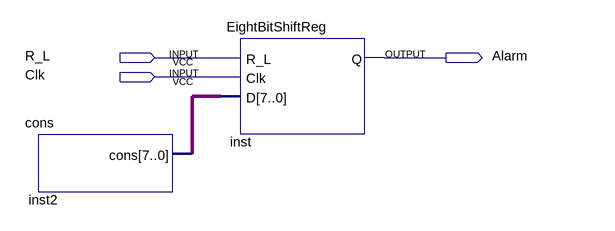
[diagram p0: schematic sheet]
// Quartus schematic Saida.bdf as structural Verilog: 2 symbols, 3 pins
module Saida (
  input  R_L,
  input  Clk,
  output Alarm
);

  wire [7:0] inst2_cons;

  cons inst2 (.cons(inst2_cons));
  EightBitShiftReg inst (.R_L(R_L), .Clk(Clk), .D(inst2_cons), .Q(Alarm));
endmodule
